# EAGLE design Obrotnica (EAGLE 6.4)
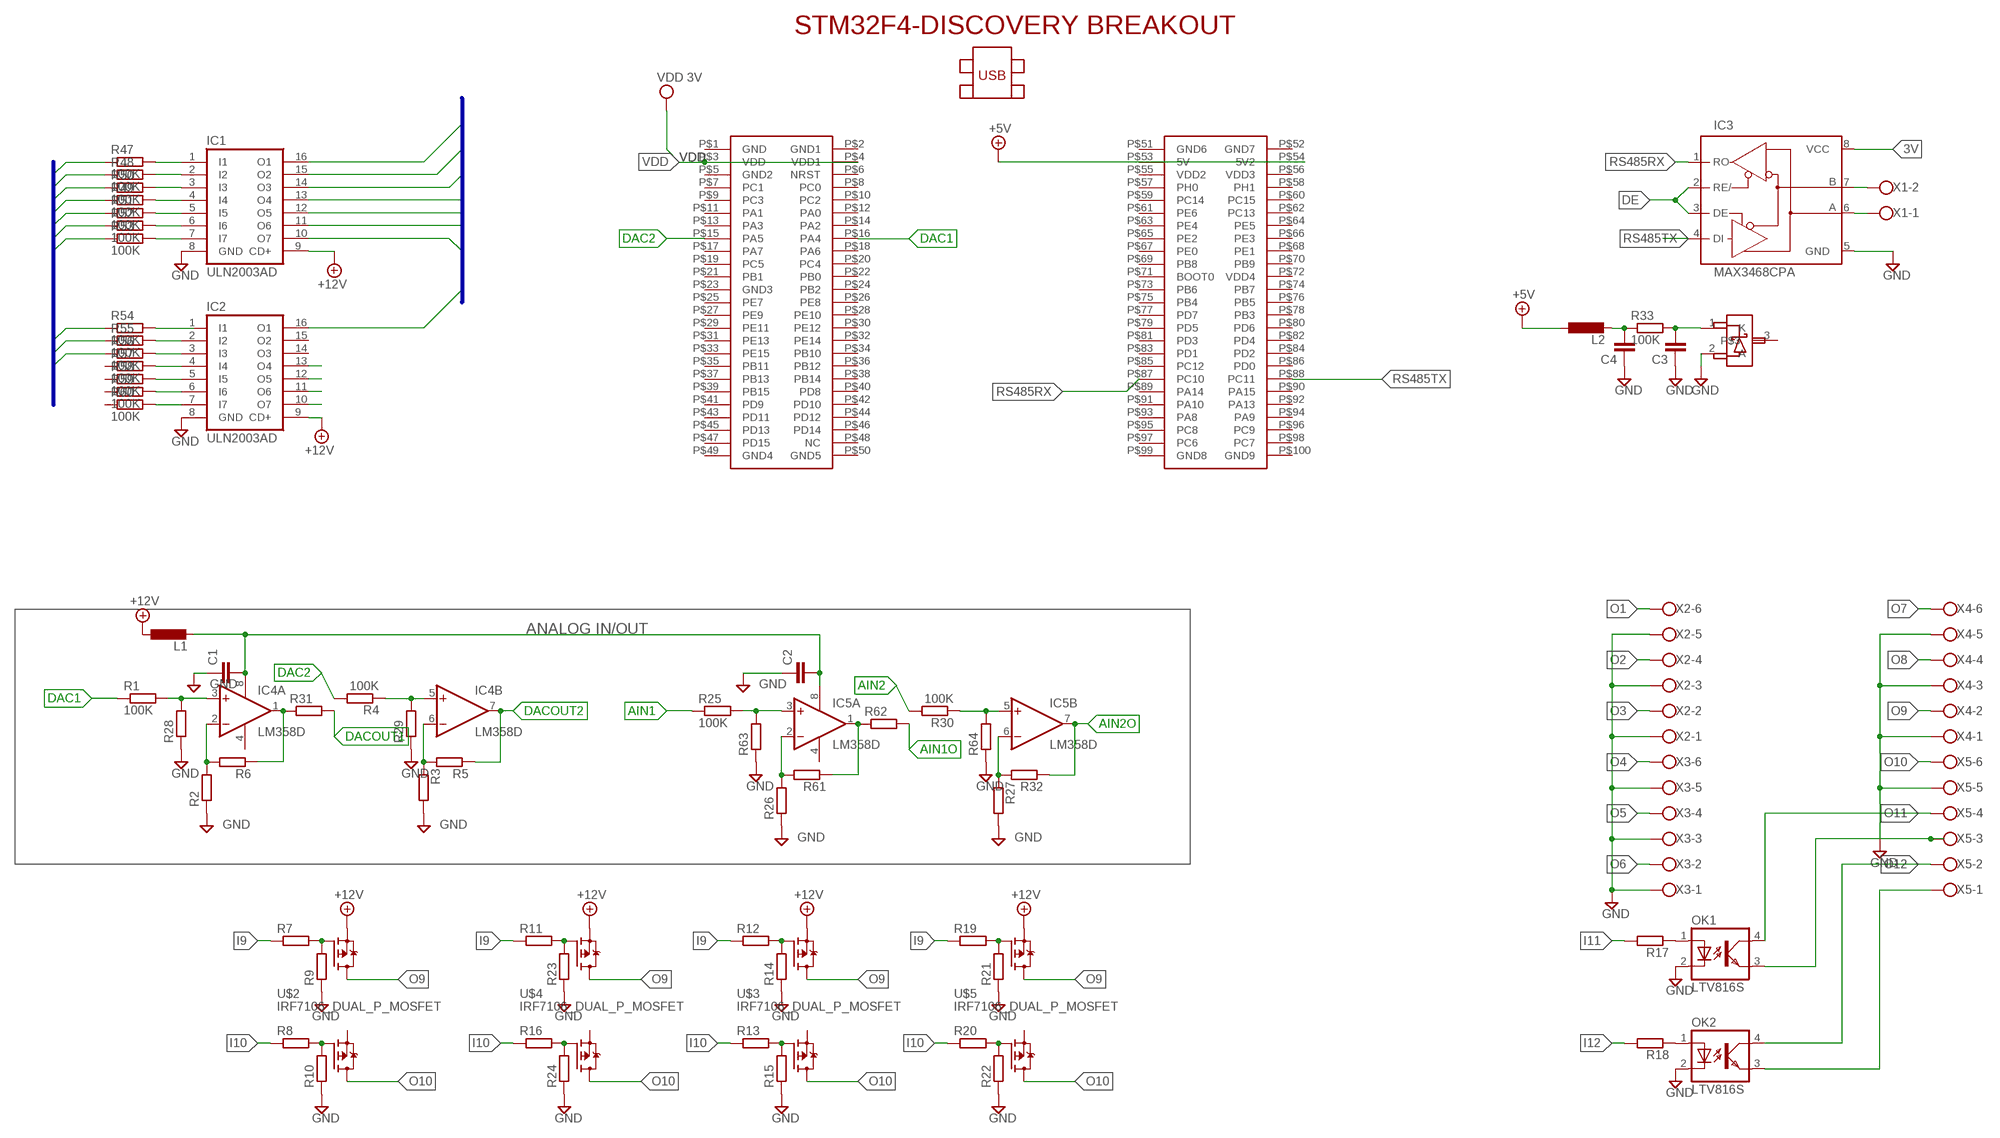
[diagram p0: schematic, sheet 1]

## Parts
C1  C-EUC1206  [C1206]
C2  C-EUC1206  [C1206]
C3  C-EUC1206  [C1206]
C4  C-EUC1206  [C1206]
IC1  ULN2003AD  [SO16]
IC2  ULN2003AD  [SO16]
IC3  MAX3468CPA  [DIL08]
IC4  LM358D  [SO08]
IC5  LM358D  [SO08]
L1  L-EU0207/7  [0207/7]
L2  L-EU0207/7  [0207/7]
OK1  LTV816S  [SMD4]
OK2  LTV816S  [SMD4]
R1  100K  R-EU_R0805  [R0805]
R2  R-EU_R0805  [R0805]
R3  R-EU_R0805  [R0805]
R4  100K  R-EU_R0805  [R0805]
R5  R-EU_R0805  [R0805]
R6  R-EU_R0805  [R0805]
R7  R-EU_M0805  [M0805]
R8  R-EU_M0805  [M0805]
R9  R-EU_M0805  [M0805]
R10  R-EU_M0805  [M0805]
R11  R-EU_M0805  [M0805]
R12  R-EU_M0805  [M0805]
R13  R-EU_M0805  [M0805]
R14  R-EU_M0805  [M0805]
R15  R-EU_M0805  [M0805]
R16  R-EU_M0805  [M0805]
R17  R-EU_M0805  [M0805]
R18  R-EU_M0805  [M0805]
R19  R-EU_M0805  [M0805]
R20  R-EU_M0805  [M0805]
R21  R-EU_M0805  [M0805]
R22  R-EU_M0805  [M0805]
R23  R-EU_M0805  [M0805]
R24  R-EU_M0805  [M0805]
R25  100K  R-EU_R0805  [R0805]
R26  R-EU_R0805  [R0805]
R27  R-EU_R0805  [R0805]
R28  R-EU_R0805  [R0805]
R29  R-EU_R0805  [R0805]
R30  100K  R-EU_R0805  [R0805]
R31  R-EU_M0805  [M0805]
R32  R-EU_R0805  [R0805]
R33  100K  R-EU_R0805  [R0805]
R47  100K  R-EU_R0805  [R0805]
R48  100K  R-EU_R0805  [R0805]
R49  100K  R-EU_R0805  [R0805]
R50  100K  R-EU_R0805  [R0805]
R51  100K  R-EU_R0805  [R0805]
R52  100K  R-EU_R0805  [R0805]
R53  100K  R-EU_R0805  [R0805]
R54  100K  R-EU_R0805  [R0805]
R55  100K  R-EU_R0805  [R0805]
R56  100K  R-EU_R0805  [R0805]
R57  100K  R-EU_R0805  [R0805]
R58  100K  R-EU_R0805  [R0805]
R59  100K  R-EU_R0805  [R0805]
R60  100K  R-EU_R0805  [R0805]
R61  R-EU_R0805  [R0805]
R62  R-EU_M0805  [M0805]
R63  R-EU_R0805  [R0805]
R64  R-EU_R0805  [R0805]
U$1  STM32F4-DISCOVERY  [STM32F4-DISCOVERY]
U$2  IRF7106_DUAL_P_MOSFET  [SO-8]
U$3  IRF7106_DUAL_P_MOSFET  [SO-8]
U$4  IRF7106_DUAL_P_MOSFET  [SO-8]
U$5  IRF7106_DUAL_P_MOSFET  [SO-8]
U$6  LM4040_2.5V  [SOT23]
X1  W237-102  [W237-102]
X2  W237-6  [W237-6]
X3  W237-6  [W237-6]
X4  W237-6  [W237-6]
X5  W237-6  [W237-6]

## Nets
1: IC4.1(A:OUT) R6.1 R31.1
2: IC5.1(A:OUT) R61.1 R62.1
3V: IC3.8(VCC)
+5V: L2.1 U$1.P$53(5V) U$1.P$54(5V2)
+12V: IC1.9(CD+) IC2.9(CD+) L1.1 U$2.1(S) U$3.1(S) U$4.1(S) U$5.1(S)
AIN1: R25.1
AIN1O: R62.2
AIN2: R30.2
AIN2O: IC5.7(B:OUT) R32.1
DAC1: R1.1 U$1.P$16(PA4)
DAC2: R4.2 U$1.P$15(PA5)
DACOUT1: R31.2
DACOUT2: IC4.7(B:OUT) R5.1
DE: IC3.2(RE/) IC3.3(DE)
GND: C1.1 C2.1 C3.1 C4.1 IC1.8(GND) IC2.8(GND) IC3.5(GND) OK1.2(C) OK2.2(C) R2.1 R3.2 R9.1 R10.1 R14.1 R15.1 R21.1 R22.1 R23.1 R24.1 R26.1 R27.2 R28.1 R29.1 R63.1 R64.1 U$6.2(A) X2.1 X2.3 X2.5 X3.1 X3.3 X3.5 X4.1 X4.3 X4.5 X5.5
I9: R7.1 R11.1 R12.1 R19.1
I10: R8.1 R13.1 R16.1 R20.1
I11: R17.2
I12: R18.2
INBUS1: R47.1
INBUS2: R48.1
INBUS3: R50.1
INBUS4: R49.1
INBUS5: R51.1
INBUS6: R52.1
INBUS7: R53.1
INBUS8: R54.1
INBUS9: R55.1
INBUS10: R56.1
N$1: IC3.6(A) X1.1
N$2: IC3.7(B) X1.2
N$3: C1.2 C2.2 IC4.8(P:V+) IC5.8(P:V+) L1.2
N$4: IC4.3(A:+IN) R1.2 R28.2
N$5: IC4.2(A:-IN) R2.2 R6.2
N$6: IC4.6(B:-IN) R3.1 R5.2
N$7: IC4.5(B:+IN) R4.1 R29.2
N$8: R7.2 R9.2 U$2.2(G)
N$9: R8.2 R10.2 U$2.4(G1)
N$10: R12.2 R14.2 U$3.2(G)
N$11: R13.2 R15.2 U$3.4(G1)
N$12: R11.2 R23.2 U$4.2(G)
N$13: R19.2 R21.2 U$5.2(G)
N$14: R20.2 R22.2 U$5.4(G1)
N$15: IC5.3(A:+IN) R25.2 R63.2
N$16: IC5.2(A:-IN) R26.2 R61.2
N$17: R16.2 R24.2 U$4.4(G1)
N$18: OK1.1(A) R17.1
N$19: OK2.1(A) R18.1
N$20: OK2.4(COL) X5.2
N$21: OK2.3(EMIT) X5.1
N$22: C3.2 R33.2 U$6.1(K)
N$23: C4.2 L2.2 R33.1
N$31: IC2.13(O4)
N$32: IC2.12(O5)
N$33: IC2.11(O6)
N$34: IC2.10(O7)
N$35: IC1.1(I1) R47.2
N$36: IC1.2(I2) R48.2
N$37: IC1.3(I3) R50.2
N$38: IC1.4(I4) R49.2
N$39: IC1.5(I5) R51.2
N$40: IC1.6(I6) R52.2
N$41: IC1.7(I7) R53.2
N$42: R54.2
N$43: IC2.2(I2) R55.2
N$44: IC2.3(I3) R56.2
N$45: IC2.4(I4) R57.2
N$46: IC2.5(I5) R58.2
N$47: IC2.6(I6) R59.2
N$48: IC2.7(I7) R60.2
N$49: IC5.6(B:-IN) R27.1 R32.2
N$50: IC5.5(B:+IN) R30.1 R64.2
O1: X2.6
O2: X2.4
O3: X2.2
O4: X3.6
O5: X3.4
O6: X3.2
O7: X4.6
O8: X4.4
O9: U$2.5(D) U$2.6(D) U$3.5(D) U$3.6(D) U$4.5(D) U$4.6(D) U$5.5(D) U$5.6(D) X4.2
O10: U$2.7(D1) U$2.8(D1) U$3.7(D1) U$3.8(D1) U$4.7(D1) U$4.8(D1) U$5.7(D1) U$5.8(D1) X5.6
O11: OK1.4(COL) X5.4
O12: OK1.3(EMIT) X5.3
OUTBUS1: IC1.16(O1)
OUTBUS2: IC1.15(O2)
OUTBUS3: IC1.14(O3)
OUTBUS4: IC1.13(O4)
OUTBUS5: IC1.12(O5)
OUTBUS6: IC1.11(O6)
OUTBUS7: IC1.10(O7)
OUTBUS8: IC2.16(O1)
RS485RX: IC3.1(RO) U$1.P$87(PC10)
RS485TX: IC3.4(DI) U$1.P$88(PC11)
VDD: U$1.P$3(VDD) U$1.P$4(VDD1) ; supply symbol labelled VDD 3V
Unconnected: IC2.1(I1) IC2.14(O3) IC2.15(O2) R57.1 R58.1 R59.1 R60.1 U$1.P$1(GND) U$1.P$2(GND1) U$1.P$5(GND2) U$1.P$6(NRST) U$1.P$7(PC1) U$1.P$8(PC0) U$1.P$9(PC3) U$1.P$10(PC2) U$1.P$11(PA1) U$1.P$12(PA0) U$1.P$13(PA3) U$1.P$14(PA2) U$1.P$17(PA7) U$1.P$18(PA6) U$1.P$19(PC5) U$1.P$20(PC4) U$1.P$21(PB1) U$1.P$22(PB0) U$1.P$23(GND3) U$1.P$24(PB2) U$1.P$25(PE7) U$1.P$26(PE8) U$1.P$27(PE9) U$1.P$28(PE10) U$1.P$29(PE11) U$1.P$30(PE12) U$1.P$31(PE13) U$1.P$32(PE14) U$1.P$33(PE15) U$1.P$34(PB10) U$1.P$35(PB11) U$1.P$36(PB12) U$1.P$37(PB13) U$1.P$38(PB14) U$1.P$39(PB15) U$1.P$40(PD8) U$1.P$41(PD9) U$1.P$42(PD10) U$1.P$43(PD11) U$1.P$44(PD12) U$1.P$45(PD13) U$1.P$46(PD14) U$1.P$47(PD15) U$1.P$48(NC) U$1.P$49(GND4) U$1.P$50(GND5) U$1.P$51(GND6) U$1.P$52(GND7) U$1.P$55(VDD2) U$1.P$56(VDD3) U$1.P$57(PH0) U$1.P$58(PH1) U$1.P$59(PC14) U$1.P$60(PC15) U$1.P$61(PE6) U$1.P$62(PC13) U$1.P$63(PE4) U$1.P$64(PE5) U$1.P$65(PE2) U$1.P$66(PE3) U$1.P$67(PE0) U$1.P$68(PE1) U$1.P$69(PB8) U$1.P$70(PB9) U$1.P$71(BOOT0) U$1.P$72(VDD4) U$1.P$73(PB6) U$1.P$74(PB7) U$1.P$75(PB4) U$1.P$76(PB5) U$1.P$77(PD7) U$1.P$78(PB3) U$1.P$79(PD5) U$1.P$80(PD6) U$1.P$81(PD3) U$1.P$82(PD4) U$1.P$83(PD1) U$1.P$84(PD2) U$1.P$85(PC12) U$1.P$86(PD0) U$1.P$89(PA14) U$1.P$90(PA15) U$1.P$91(PA10) U$1.P$92(PA13) U$1.P$93(PA8) U$1.P$94(PA9) U$1.P$95(PC8) U$1.P$96(PC9) U$1.P$97(PC6) U$1.P$98(PC7) U$1.P$99(GND8) U$1.P$100(GND9) U$2.3(S1) U$3.3(S1) U$4.3(S1) U$5.3(S1) U$6.3

## Buses
INBUS[1..10]
OUTBUS[1..8]

## Notes on the sheet
- ANALOG IN/OUT

## Power pins joined to a net without a drawn wire
V-: IC4.4(P:V-) IC5.4(P:V-)

## Library data of the parts
C1-C4 = rcl:C-EU: CAPACITOR, European symbol
IC1 IC2 = uln-udn:ULN2003A: DRIVER ARRAY
IC3 = maxim:MAX34*: +5V, Fail-Safe, 40Mbps, Profibus RS-485/RS-422 Transceivers Source: MAX3465-MAX3469.pdf; OC_FARNELL: unknown; OC_NEWARK: unknown
IC4 IC5 = linear:LM358: OP AMP also LM158; LM258; LM2904 Source: http://cache.national.com/ds/LM/LM158.pdf
L1 L2 = rcl:L-EU: INDUCTOR, European symbol
OK1 OK2 = optocoupler:LTV816: OPTO COUPLER Source: LITEON, LTV816.pdf; OC_FARNELL: unknown; OC_NEWARK: unknown
R1-R6 R25-R30 R32 R33 R47-R61 R63 R64 = resistor:R-EU_: RESISTOR, European symbol
R7-R24 R31 R62 = rcl:R-EU_: RESISTOR, European symbol
U$1 = STM32F4-DISCOVERY:STM32F4-DISCOVERY
U$2-U$5 = transistor-fet:IRF7106_DUAL_P_MOSFET
U$6 = Discovery F4:LM4040_2.5V
X1 = con-wago-500:W237-102: WAGO SCREW CLAMP; MPN: 237-102; OC_FARNELL: unknown; OC_NEWARK: 70K9898
X2-X5 = con-wago-500:W237-6: WAGO SCREW CLAMP; OC_FARNELL: unknown; OC_NEWARK: unknown

## Board
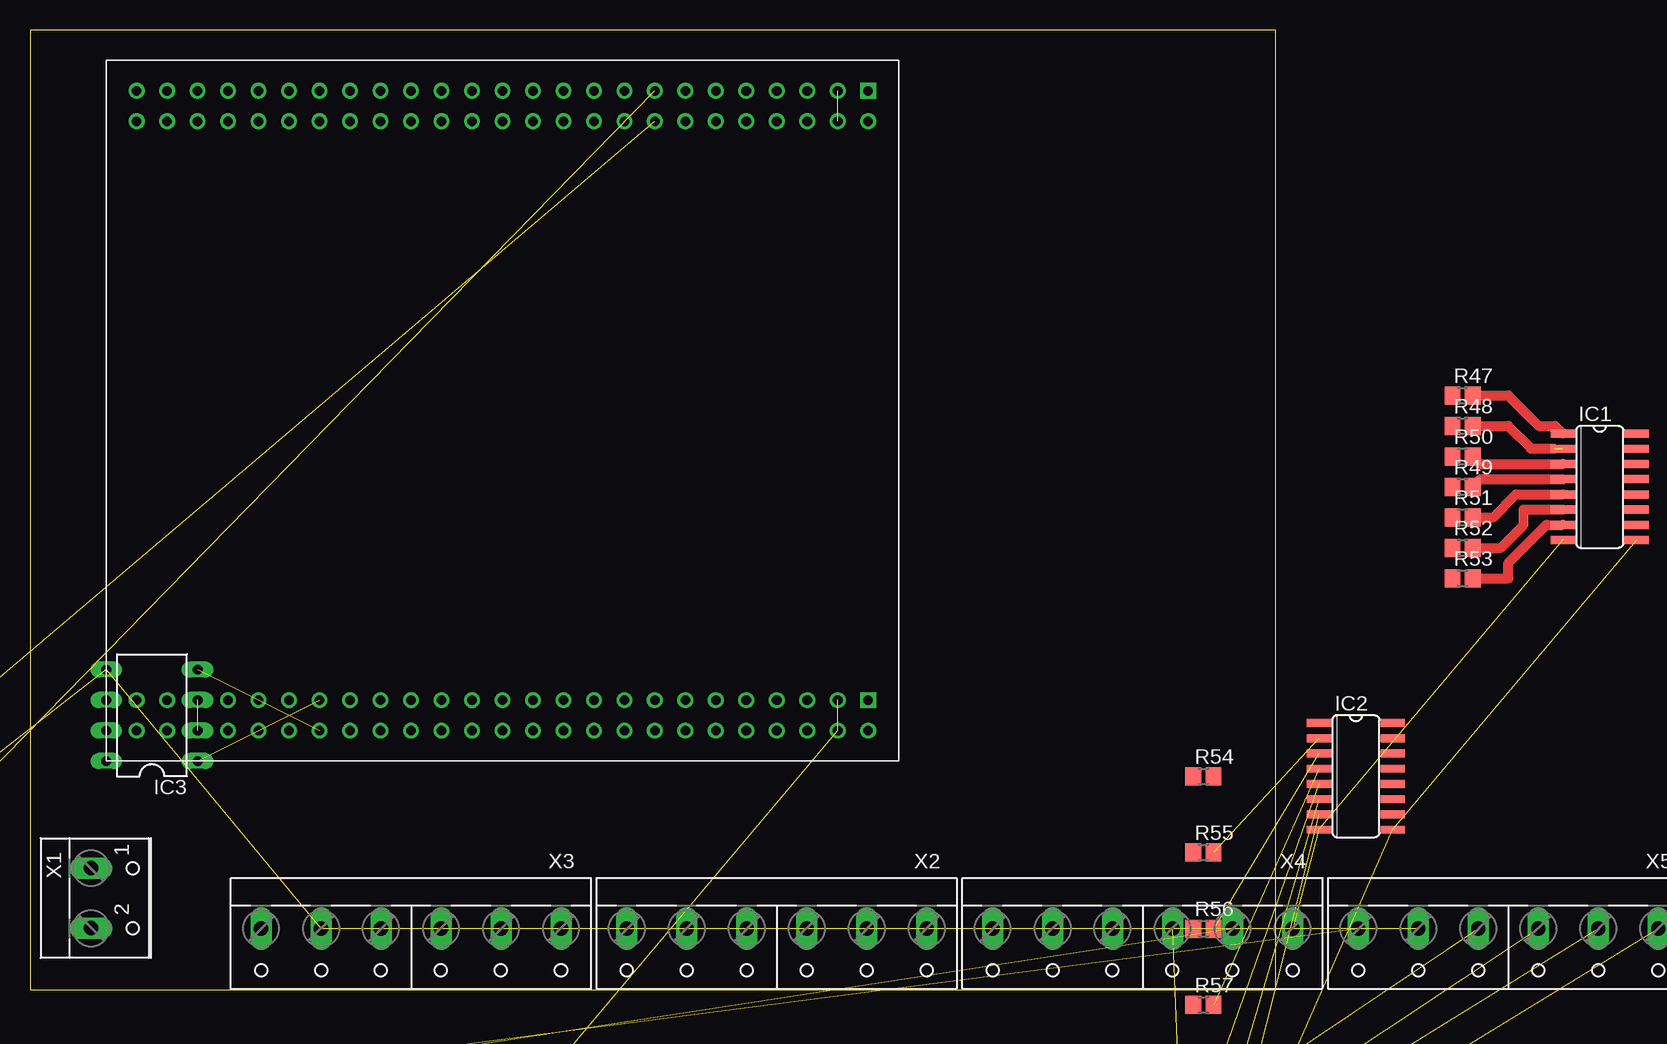
[diagram p1: board, top side]
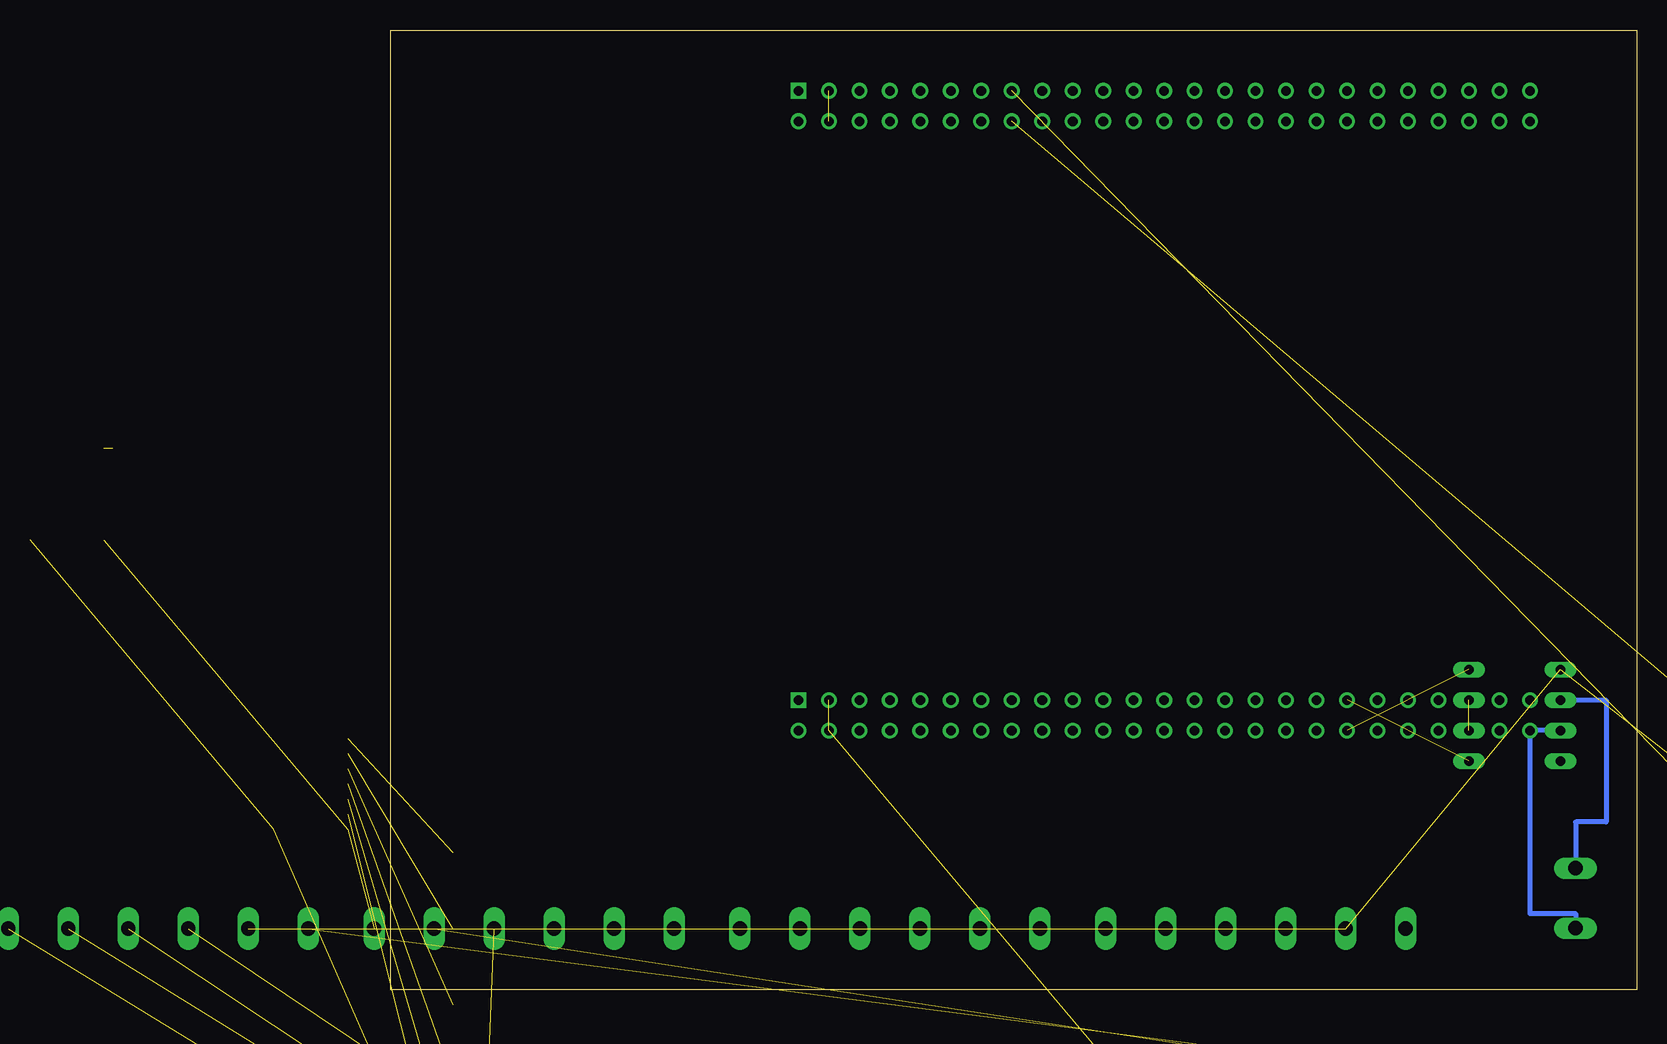
[diagram p2: board, bottom side, seen from below]

Size 103.81 x 80 mm. Coordinates in mm from the lower left corner, seen from the top.
Outline: 0,0 103.81,0 103.81,80 0,80 0,0
Copper layers (1*16): Top 0.035mm / dielectric 1.5mm / Bottom 0.035mm
Design rules "default": minimum track width 10mil, minimum drill 24mil, track to track 8mil, track to pad 8mil, pad to pad 8mil, via to via 8mil, smd to smd 8mil, copper to edge 40mil, drill to drill 8mil, minimum pad ring 10mil, minimum via ring 8mil, stop-mask expansion 4mil, vias tented up to drill 0mil, thermal gap 10mil

### Footprints (pad centres in the part's own frame; a part is rotated, then mirrored left to right if it is on the bottom)
C1206 = smd 1.6 x 1.8: 1 -1.4,0; 2 1.4,0
SO16 = smd 0.66 x 2.032: 1 -4.445,-3.073; 2 -3.175,-3.073; 3 -1.905,-3.073; 4 -0.635,-3.073; 5 0.635,-3.073; 6 1.905,-3.073; 7 3.175,-3.073; 8 4.445,-3.073; 9 4.445,3.073; 10 3.175,3.073; 11 1.905,3.073; 12 0.635,3.073; 13 -0.635,3.073; 14 -1.905,3.073; 15 -3.175,3.073; 16 -4.445,3.073
DIL08 = drill 0.813 long: 1 -3.81,-3.81; 2 -1.27,-3.81; 3 1.27,-3.81; 4 3.81,-3.81; 5 3.81,3.81; 6 1.27,3.81; 7 -1.27,3.81; 8 -3.81,3.81
SO08 = smd 0.6 x 2.2: 1 -1.905,-2.6; 2 -0.635,-2.6; 3 0.635,-2.6; 4 1.905,-2.6; 5 1.905,2.6; 6 0.635,2.6; 7 -0.635,2.6; 8 -1.905,2.6
0207/7 = drill 0.813 octagon: 1 -3.81,0; 2 3.81,0
SMD4 = smd 1.78 x 1.55: 1 -1.27,-3.5; 2 1.27,-3.5; 3 1.27,3.5; 4 -1.27,3.5
R0805 = smd 1.3 x 1.5: 1 -0.85,0; 2 0.85,0
M0805 = smd 1.3 x 1.6: 1 -0.95,0; 2 0.95,0
STM32F4-DISCOVERY = drill 0.8 square: P$1 -27.94,30.48; P$51 22.86,30.48 | drill 0.8: P$2 -25.4,30.48; P$3 -27.94,27.94; P$4 -25.4,27.94; P$5 -27.94,25.4; P$6 -25.4,25.4; P$7 -27.94,22.86; P$8 -25.4,22.86; P$9 -27.94,20.32; P$10 -25.4,20.32; P$11 -27.94,17.78; P$12 -25.4,17.78; P$13 -27.94,15.24; P$14 -25.4,15.24; P$15 -27.94,12.7; P$16 -25.4,12.7; P$17 -27.94,10.16; P$18 -25.4,10.16; P$19 -27.94,7.62; P$20 -25.4,7.62; P$21 -27.94,5.08; P$22 -25.4,5.08; P$23 -27.94,2.54; P$24 -25.4,2.54; P$25 -27.94,0; P$26 -25.4,0; P$27 -27.94,-2.54; P$28 -25.4,-2.54; P$29 -27.94,-5.08; P$30 -25.4,-5.08; P$31 -27.94,-7.62; P$32 -25.4,-7.62; P$33 -27.94,-10.16; P$34 -25.4,-10.16; P$35 -27.94,-12.7; P$36 -25.4,-12.7; P$37 -27.94,-15.24; P$38 -25.4,-15.24; P$39 -27.94,-17.78; P$40 -25.4,-17.78; P$41 -27.94,-20.32; P$42 -25.4,-20.32; P$43 -27.94,-22.86; P$44 -25.4,-22.86; P$45 -27.94,-25.4; P$46 -25.4,-25.4; P$47 -27.94,-27.94; P$48 -25.4,-27.94; P$49 -27.94,-30.48; P$50 -25.4,-30.48; P$52 25.4,30.48; P$53 22.86,27.94; P$54 25.4,27.94; P$55 22.86,25.4; P$56 25.4,25.4; P$57 22.86,22.86; P$58 25.4,22.86; P$59 22.86,20.32; P$60 25.4,20.32; P$61 22.86,17.78; P$62 25.4,17.78; P$63 22.86,15.24; P$64 25.4,15.24; P$65 22.86,12.7; P$66 25.4,12.7; P$67 22.86,10.16; P$68 25.4,10.16; P$69 22.86,7.62; P$70 25.4,7.62; P$71 22.86,5.08; P$72 25.4,5.08; P$73 22.86,2.54; P$74 25.4,2.54; P$75 22.86,0; P$76 25.4,0; P$77 22.86,-2.54; P$78 25.4,-2.54; P$79 22.86,-5.08; P$80 25.4,-5.08; P$81 22.86,-7.62; P$82 25.4,-7.62; P$83 22.86,-10.16; P$84 25.4,-10.16; P$85 22.86,-12.7; P$86 25.4,-12.7; P$87 22.86,-15.24; P$88 25.4,-15.24; P$89 22.86,-17.78; P$90 25.4,-17.78; P$91 22.86,-20.32; P$92 25.4,-20.32; P$93 22.86,-22.86; P$94 25.4,-22.86; P$95 22.86,-25.4; P$96 25.4,-25.4; P$97 22.86,-27.94; P$98 25.4,-27.94; P$99 22.86,-30.48; P$100 25.4,-30.48
SO-8 = smd 1.524 x 0.61: 1 -2.743,1.905; 2 -2.743,0.635; 3 -2.743,-0.635; 4 -2.743,-1.905; 5 2.743,-1.905; 6 2.743,-0.635; 7 2.743,0.635; 8 2.743,1.905
SOT23 = smd 1 x 1.4: 1 -0.95,-1.1; 2 0.95,-1.1; 3 0,1.1
W237-102 = drill 1.194 long: 1 -2.5,-1.27; 2 2.5,-1.27
W237-6 = drill 1.194 long: 1 -12.5,-1.27; 2 -7.5,-1.27; 3 -2.5,-1.27; 4 2.5,-1.27; 5 7.5,-1.27; 6 12.5,-1.27

### Placement (x,y rotation side)
C1  -107.95,-172.72 0 top  (outside the outline)
C2  -107.95,-177.8 0 top  (outside the outline)
C3  -107.95,-199.39 0 top  (outside the outline)
C4  -107.95,-204.47 0 top  (outside the outline)
IC1  130.81,41.91 270 top  (outside the outline)
IC2  110.49,17.78 270 top  (outside the outline)
IC3  10.16,22.86 90 top
IC4  -35.56,3.81 0 top  (outside the outline)
IC5  59.69,-71.12 0 top  (outside the outline)
L1  -105.41,-182.88 0 top  (outside the outline)
L2  -105.41,-187.96 0 top  (outside the outline)
OK1  -97.79,-146.05 0 top  (outside the outline)
OK2  -106.68,-146.05 0 top  (outside the outline)
R1  -36.83,-3.81 0 top  (outside the outline)
R2  -36.83,-7.62 0 top  (outside the outline)
R3  -36.83,-11.43 0 top  (outside the outline)
R4  -36.83,-15.24 0 top  (outside the outline)
R5  -36.83,-19.05 0 top  (outside the outline)
R6  -36.83,-22.86 0 top  (outside the outline)
R7  102.87,-35.56 0 top  (outside the outline)
R8  107.95,-35.56 0 top  (outside the outline)
R9  97.79,-40.64 0 top  (outside the outline)
R10  97.79,-35.56 0 top  (outside the outline)
R11  -91.44,-48.26 0 top  (outside the outline)
R12  97.79,-54.61 0 top  (outside the outline)
R13  102.87,-54.61 0 top  (outside the outline)
R14  107.95,-54.61 0 top  (outside the outline)
R15  97.79,-59.69 0 top  (outside the outline)
R16  -91.44,-73.66 0 top  (outside the outline)
R17  -107.95,-154.94 0 top  (outside the outline)
R18  -107.95,-160.02 0 top  (outside the outline)
R19  86.36,-68.58 0 top  (outside the outline)
R20  69.85,-69.85 0 top  (outside the outline)
R21  90.17,-76.2 0 top  (outside the outline)
R22  69.85,-72.39 0 top  (outside the outline)
R23  -91.44,-109.22 0 top  (outside the outline)
R24  -91.44,-114.3 0 top  (outside the outline)
R25  60.96,-78.74 90 top  (outside the outline)
R26  69.85,-74.93 0 top  (outside the outline)
R27  73.66,-86.36 0 top  (outside the outline)
R28  -107.95,-163.83 0 top  (outside the outline)
R29  -107.95,-167.64 0 top  (outside the outline)
R30  62.23,-63.5 0 top  (outside the outline)
R31  -91.44,-149.86 0 top  (outside the outline)
R32  102.87,-100.33 0 top  (outside the outline)
R33  -107.95,-193.04 0 top  (outside the outline)
R47  119.38,49.53 0 top  (outside the outline)
R48  119.38,46.99 0 top  (outside the outline)
R49  119.38,41.91 0 top  (outside the outline)
R50  119.38,44.45 0 top  (outside the outline)
R51  119.38,39.37 0 top  (outside the outline)
R52  119.38,36.83 0 top  (outside the outline)
R53  119.38,34.29 0 top  (outside the outline)
R54  97.79,17.78 0 top
R55  97.79,11.43 0 top
R56  97.79,5.08 0 top
R57  97.79,-1.27 0 top
R58  97.79,-7.62 0 top  (outside the outline)
R59  97.79,-13.97 0 top  (outside the outline)
R60  97.79,-20.32 0 top  (outside the outline)
R61  55.88,-82.55 0 top  (outside the outline)
R62  53.34,-77.47 270 top  (outside the outline)
R63  97.79,-104.14 0 top  (outside the outline)
R64  102.87,-104.14 0 top  (outside the outline)
U$1  39.37,46.99 270 top
U$2  99.06,-27.94 0 top  (outside the outline)
U$3  99.06,-46.99 0 top  (outside the outline)
U$4  -63.5,-19.05 0 top  (outside the outline)
U$5  99.06,-66.04 0 top  (outside the outline)
U$6  97.79,-109.22 0 top  (outside the outline)
X1  6.35,7.62 270 top
X2  62.23,3.81 180 top
X3  31.75,3.81 180 top
X4  92.71,3.81 180 top
X5  123.19,3.81 180 top  (outside the outline)

### Tracks (layer width: path | path; a pad name or v marks a point on that pad's centre or on a via)
1  (2 unrouted)
2  (2 unrouted)
+5V  (2 unrouted)
+12V  (6 unrouted)
AIN2O  (1 unrouted)
DAC1  (1 unrouted)
DAC2  (1 unrouted)
DACOUT2  (1 unrouted)
DE  (1 unrouted)
GND  (35 unrouted)
I9  (3 unrouted)
I10  (3 unrouted)
N$1
  Bottom 0.406: IC3.6 2.54,24.13 2.54,13.97 5.08,13.97 X1.1
N$2
  Bottom 0.406: IC3.7 8.89,21.59 8.89,6.35 5.08,6.35 X1.2 5.08,5.08
N$3  (4 unrouted)
N$4  (2 unrouted)
N$5  (2 unrouted)
N$6  (2 unrouted)
N$7  (2 unrouted)
N$8  (2 unrouted)
N$9  (2 unrouted)
N$10  (2 unrouted)
N$11  (2 unrouted)
N$12  (2 unrouted)
N$13  (2 unrouted)
N$14  (2 unrouted)
N$15  (2 unrouted)
N$16  (2 unrouted)
N$17  (2 unrouted)
N$18  (1 unrouted)
N$19  (1 unrouted)
N$20  (1 unrouted)
N$21  (1 unrouted)
N$22  (2 unrouted)
N$23  (2 unrouted)
N$35
  Top 0.813: R47.2 123.19,49.53 125.73,46.99 127.1,46.99 IC1.1
N$36  (1 unrouted)
  Top 0.813: R48.2 123.19,46.99 125.09,45.09 127,45.09
N$37
  Top 0.813: R50.2 120.86,43.81 IC1.3
N$38
  Top 0.813: R49.2 120.86,42.55 IC1.4
N$39
  Top 0.813: R51.2 121.92,39.37 123.83,41.27 IC1.5
N$40
  Top 0.813: R52.2 122.56,36.83 124.46,38.73 124.46,40.01 IC1.6
N$41
  Top 0.813: R53.2 123.19,34.29 123.19,35.56 126.36,38.73 IC1.7
N$43  (1 unrouted)
N$44  (1 unrouted)
N$45  (1 unrouted)
N$46  (1 unrouted)
N$47  (1 unrouted)
N$48  (1 unrouted)
N$49  (2 unrouted)
N$50  (2 unrouted)
O9  (8 unrouted)
O10  (8 unrouted)
O11  (1 unrouted)
O12  (1 unrouted)
RS485RX  (1 unrouted)
RS485TX  (1 unrouted)
V-  (1 unrouted)
VDD  (1 unrouted)